# EAGLE design n64rgbv2 (EAGLE 9.2.2)
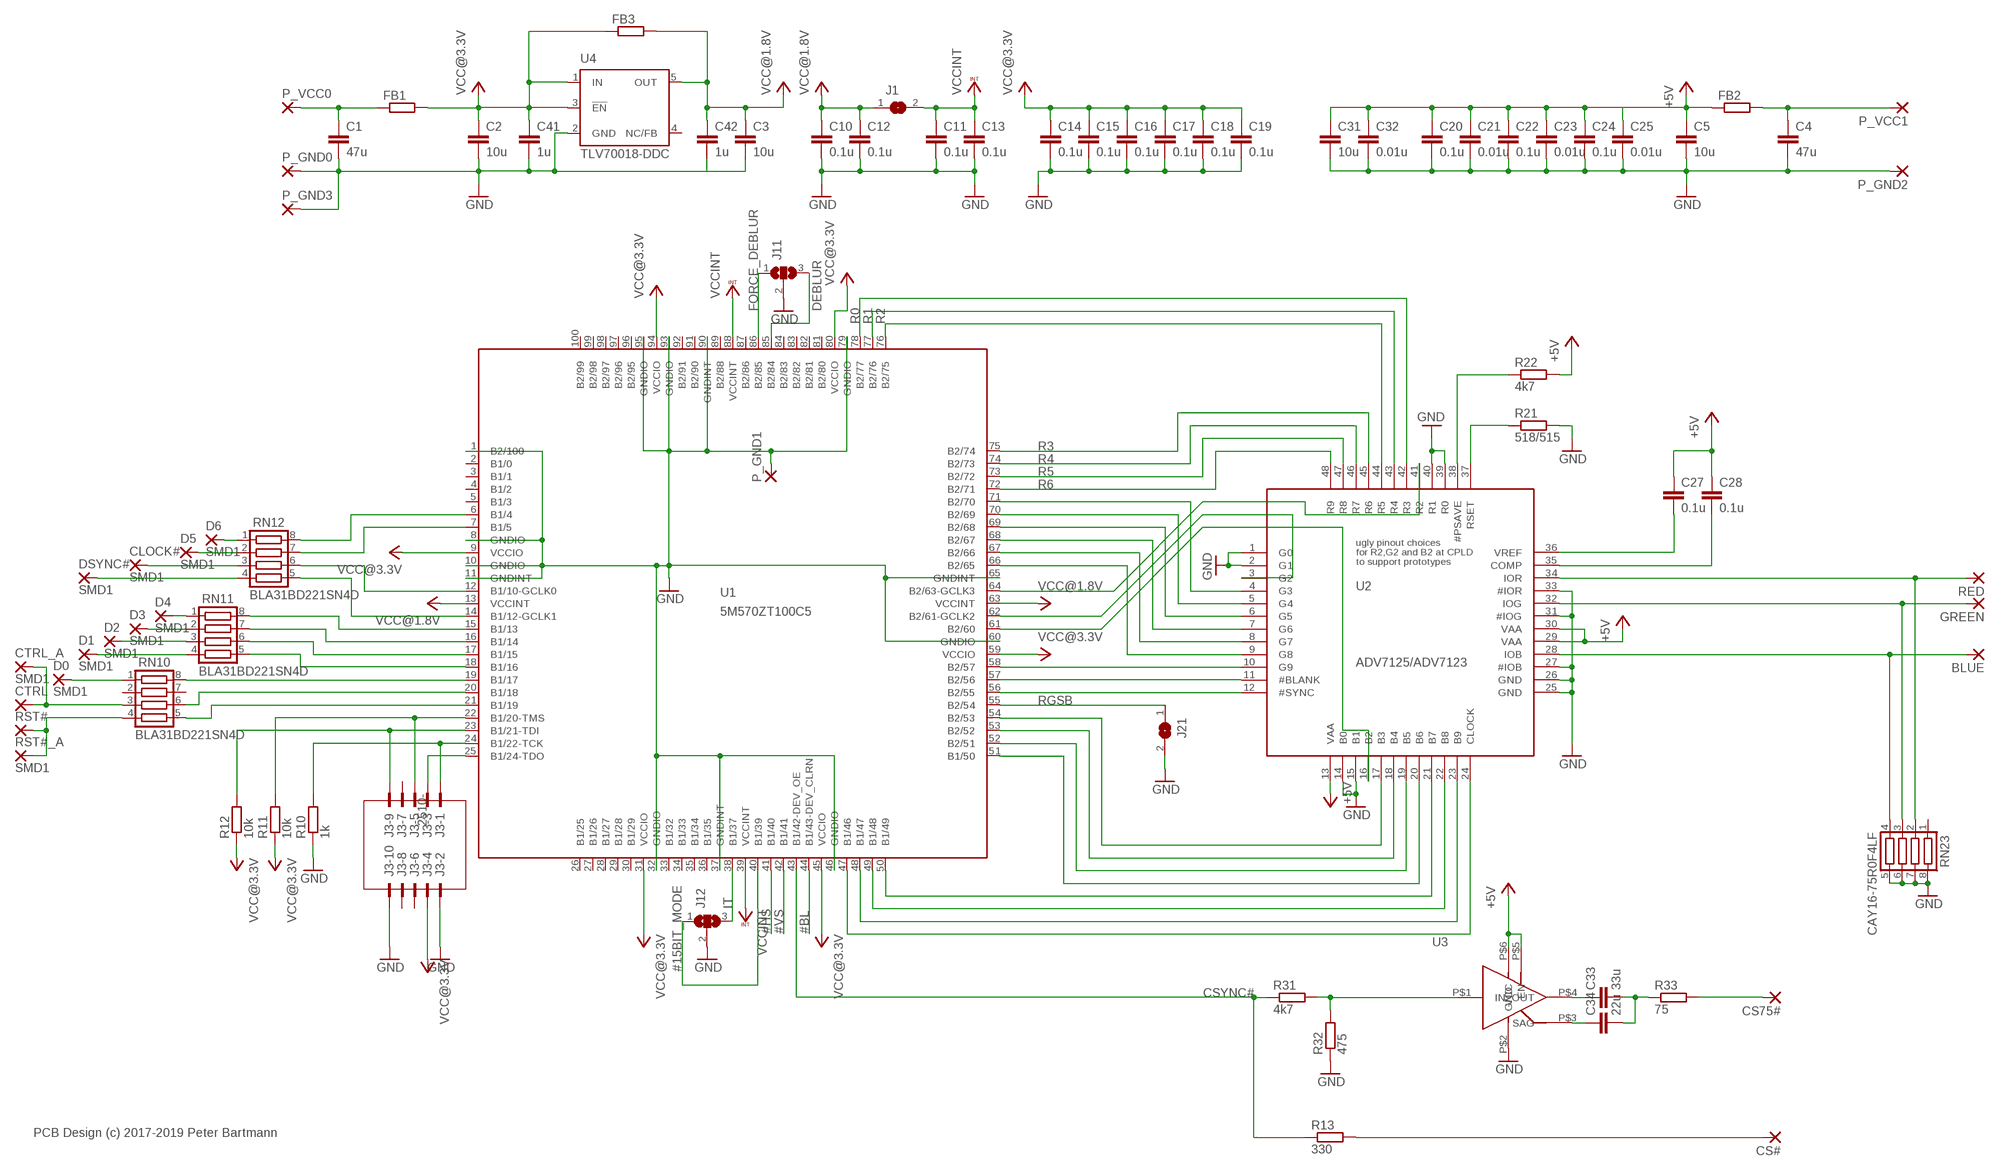
[diagram p0: schematic, sheet 1]

## Parts
BLUE  SMD2  [SMD1,27-2,54]
C1  47u  C-EUC0805  [C0805]
C2  10u  C-EUC0805  [C0805]
C3  10u  C-EUC0805  [C0805]
C4  47u  C-EUC0805  [C0805]
C5  10u  C-EUC0805  [C0805]
C10  0.1u  C-EUC0603  [C0603]
C11  0.1u  C-EUC0603  [C0603]
C12  0.1u  C-EUC0603  [C0603]
C13  0.1u  C-EUC0603  [C0603]
C14  0.1u  C-EUC0603  [C0603]
C15  0.1u  C-EUC0603  [C0603]
C16  0.1u  C-EUC0603  [C0603]
C17  0.1u  C-EUC0603  [C0603]
C18  0.1u  C-EUC0603  [C0603]
C19  0.1u  C-EUC0603  [C0603]
C20  0.1u  C-EUC0603  [C0603]
C21  0.01u  C-EUC0603  [C0603]
C22  0.1u  C-EUC0603  [C0603]
C23  0.01u  C-EUC0603  [C0603]
C24  0.1u  C-EUC0603  [C0603]
C25  0.01u  C-EUC0603  [C0603]
C27  0.1u  C-EUC0603  [C0603]
C28  0.1u  C-EUC0603  [C0603]
C31  10u  C-EUC0805  [C0805]
C32  0.01u  C-EUC0603  [C0603]
C33  33u  C-EUC1210  [C1210]
C34  22u  C-EUC1206  [C1206]
C41  1u  C-EUC0603  [C0603]
C42  1u  C-EUC0603  [C0603]
CLOCK#  SMD1  [SMD0,8-1,6]
CS75#  SMD2  [SMD1,27-2,54]
CS#  SMD2  [SMD1,27-2,54]
CTRL  SMD2  [SMD1,27-2,54]
CTRL_A  SMD1  [SMD0,8-1,6]
D0  SMD1  [SMD0,8-1,6]
D1  SMD1  [SMD0,8-1,6]
D2  SMD1  [SMD0,8-1,6]
D3  SMD1  [SMD0,8-1,6]
D4  SMD1  [SMD0,8-1,6]
D5  SMD1  [SMD0,8-1,6]
D6  SMD1  [SMD0,8-1,6]
DSYNC#  SMD1  [SMD0,8-1,6]
FB1  R-EU_R0603  [R0603]
FB2  R-EU_R0603  [R0603]
FB3  R-EU_R0603  [R0603]
GREEN  SMD2  [SMD1,27-2,54]
J1  SJ  [SJ]
J3  2510-  [PAK100/2500-10]
J11  SJ2W  [SJ_2]
J12  SJ2W  [SJ_2]
J21  SJ  [SJ]
P_GND0  SMD2  [SMD1,27-2,54]
P_GND1  SMD2  [SMD1,27-2,54]
P_GND2  SMD2  [SMD1,27-2,54]
P_GND3  SMD2  [SMD1,27-2,54]
P_VCC0  SMD2  [SMD1,27-2,54]
P_VCC1  SMD2  [SMD1,27-2,54]
R10  1k  R-EU_R0603  [R0603]
R11  10k  R-EU_R0603  [R0603]
R12  10k  R-EU_R0603  [R0603]
R13  330  R-EU_R0603  [R0603]
R21  518/515  R-EU_R0603  [R0603]
R22  4k7  R-EU_R0603  [R0603]
R31  4k7  R-EU_R0603  [R0603]
R32  475  R-EU_R0603  [R0603]
R33  75  R-EU_R0603  [R0603]
RED  SMD2  [SMD1,27-2,54]
RN10  BLA31BD221SN4D  CTS742C083  [CTS742C083]
RN11  BLA31BD221SN4D  CTS742C083  [CTS742C083]
RN12  BLA31BD221SN4D  CTS742C083  [CTS742C083]
RN23  CAY16-75R0F4LF  CTS742C083  [CTS742C083]
RST#  SMD2  [SMD1,27-2,54]
RST#_A  SMD1  [SMD0,8-1,6]
U1  5M570ZT100C5  [TQFP100]
U2  ADV7125/ADV7123  ADV7123  [LQFP48]
U3  TSH122ICT  [SC70]
U4  TLV70018-DDC  TPS77018  [SOT23-DBV]

## Nets
#15BIT_MODE: J12.1 U1.40(B1/39)
#BL: U1.44(B1/43-DEV_CLRN)
#HS: U1.41(B1/40)
#VS: U1.42(B1/41)
+5V: C5.1 C20.1 C21.1 C22.1 C23.1 C24.1 C25.1 C27.1 C28.1 C31.1 C32.1 FB2.1 R22.2 U2.13(VAA) U2.29(VAA) U2.30(VAA) U3.P$5(EN) U3.P$6(VCC)
BLUE: BLUE.1(P) RN23.4 U2.28(IOB)
CSYNC#: R13.1 R31.1 U1.43(B1/42-DEV_OE)
DEBLUR: J11.3 U1.85(B2/84)
FORCE_DEBLUR: J11.1 U1.86(B2/85)
GND: C1.2 C2.2 C3.2 C4.2 C5.2 C10.2 C11.2 C12.2 C13.2 C14.2 C15.2 C16.2 C17.2 C18.2 C19.2 C20.2 C21.2 C22.2 C23.2 C24.2 C25.2 C31.2 C32.2 C41.2 C42.2 J3.2 J3.10 J11.2 J12.2 J21.2 P_GND0.1(P) P_GND1.1(P) P_GND2.1(P) P_GND3.1(P) R10.1 R21.2 R32.1 RN23.5 RN23.6 RN23.7 RN23.8 U1.1(B2/100) U1.8(GNDIO) U1.10(GNDIO) U1.11(GNDINT) U1.32(GNDIO) U1.37(GNDINT) U1.46(GNDIO) U1.60(GNDIO) U1.65(GNDINT) U1.79(GNDIO) U1.90(GNDINT) U1.93(GNDIO) U1.95(GNDIO) U2.1(G0) U2.2(G1) U2.14(B0) U2.15(B1) U2.25(GND) U2.26(GND) U2.27(#IOB) U2.31(#IOG) U2.33(#IOR) U2.39(R0) U2.40(R1) U3.P$2(GND) U4.2(GND)
GREEN: GREEN.1(P) RN23.3 U2.32(IOG)
IT: J12.3 U1.38(B1/37)
N$1: D6.P$1(P) RN12.1
N$2: D5.P$1(P) RN12.2
N$3: DSYNC#.P$1(P) RN12.4
N$4: CLOCK#.P$1(P) RN12.3
N$5: RN10.4 RST#.1(P) RST#_A.P$1(P)
N$6: CTRL.1(P) CTRL_A.P$1(P) RN10.3
N$7: D0.P$1(P) RN10.1
N$8: RN10.8 U1.19(B1/17)
N$9: RN10.6 U1.20(B1/18)
N$10: RN10.5 U1.21(B1/19)
N$11: RN11.5 U1.18(B1/16)
N$12: RN11.6 U1.17(B1/15)
N$13: CS#.1(P) R13.2
N$14: RN11.7 U1.16(B1/14)
N$15: RN11.8 U1.15(B1/13)
N$16: D1.P$1(P) RN11.4
N$17: D2.P$1(P) RN11.3
N$18: D3.P$1(P) RN11.2
N$19: D4.P$1(P) RN11.1
N$20: RN12.7 U1.7(B1/5)
N$21: RN12.8 U1.6(B1/4)
N$22: RN12.5 U1.14(B1/12-GCLK1)
N$23: RN12.6 U1.12(B1/10-GCLK0)
N$24: U1.71(B2/70) U2.4(G3)
N$25: U1.64(B2/63-GCLK3) U2.41(R2)
N$26: U1.70(B2/69) U2.5(G4)
N$27: U1.69(B2/68) U2.6(G5)
N$28: U1.68(B2/67) U2.7(G6)
N$29: U1.67(B2/66) U2.8(G7)
N$30: U1.66(B2/65) U2.9(G8)
N$31: U1.58(B2/57) U2.10(G9)
N$32: U1.56(B2/55) U2.12(#SYNC)
N$33: U1.47(B1/46) U2.24(CLOCK)
N$34: U1.48(B1/47) U2.23(B9)
N$35: U1.49(B1/48) U2.22(B8)
N$36: U1.50(B1/49) U2.21(B7)
N$37: U1.51(B1/50) U2.20(B6)
N$38: U1.52(B2/51) U2.19(B5)
N$39: U1.53(B2/52) U2.18(B4)
N$40: U1.54(B2/53) U2.17(B3)
N$41: U1.62(B2/61-GCLK2) U2.3(G2)
N$42: U1.57(B2/56) U2.11(#BLANK)
N$43: U1.61(B2/60) U2.16(B2)
N$44: C4.1 FB2.2 P_VCC1.1(P)
N$54: C1.1 FB1.1 P_VCC0.1(P)
N$57: C33.2 C34.2 R33.1
N$58: CS75#.1(P) R33.2
N$59: C33.1 U3.P$4(OUT)
N$60: C34.1 U3.P$3(SAG)
N$61: R21.1 U2.37(RSET)
N$62: R22.1 U2.38(#PSAVE)
N$63: C28.2 U2.35(COMP)
N$64: R31.2 R32.2 U3.P$1(IN)
N$88: C27.2 U2.36(VREF)
R0: U1.78(B2/77) U2.42(R3)
R1: U1.77(B2/76) U2.43(R4)
R2: U1.76(B2/75) U2.44(R5)
R3: U1.75(B2/74) U2.45(R6)
R4: U1.74(B2/73) U2.46(R7)
R5: U1.73(B2/72) U2.47(R8)
R6: U1.72(B2/71) U2.48(R9)
RED: RED.1(P) RN23.2 U2.34(IOR)
RGSB: J21.1 U1.55(B2/54)
TCK: J3.1 R10.2 U1.24(B1/22-TCK)
TDI: J3.9 R12.2 U1.23(B1/21-TDI)
TDO: J3.3 U1.25(B1/24-TDO)
TMS: J3.5 R11.2 U1.22(B1/20-TMS)
VCC@1.8V: C3.1 C10.1 C12.1 C42.1 FB3.2 J1.1 U1.13(VCCINT) U1.63(VCCINT) U4.5(OUT)
VCC@3.3V: C2.1 C14.1 C15.1 C16.1 C17.1 C18.1 C19.1 C41.1 FB1.2 FB3.1 J3.4 R11.1 R12.1 U1.9(VCCIO) U1.31(VCCIO) U1.45(VCCIO) U1.59(VCCIO) U1.80(VCCIO) U1.94(VCCIO) U4.1(IN) U4.3(!EN)
VCCINT: C11.1 C13.1 J1.2 U1.39(VCCINT) U1.88(VCCINT)
Unconnected: J3.6 J3.7 J3.8 RN10.2 RN10.7 RN23.1 U1.2(B1/0) U1.3(B1/1) U1.4(B1/2) U1.5(B1/3) U1.26(B1/25) U1.27(B1/26) U1.28(B1/27) U1.29(B1/28) U1.30(B1/29) U1.33(B1/32) U1.34(B1/33) U1.35(B1/34) U1.36(B1/35) U1.81(B2/80) U1.82(B2/81) U1.83(B2/82) U1.84(B2/83) U1.87(B2/86) U1.89(B2/88) U1.91(B2/90) U1.92(B2/91) U1.96(B2/95) U1.97(B2/96) U1.98(B2/97) U1.99(B2/98) U1.100(B2/99) U4.4(NC/FB)

## Notes on the sheet
- ugly pinout choices
  for R2,G2 and B2 at CPLD
  to support prototypes
- PCB Design (c) 2017-2019 Peter Bartmann

## Library data of the parts
BLUE CS75# CS# CTRL GREEN P_GND0 P_GND1-P_GND3 P_VCC0 P_VCC1 RED RST# = wirepad:SMD2: SMD PAD
C1-C5 C10-C25 C27 C28 C31 C32 C34 C41 C42 = rcl:C-EU: CAPACITOR, European symbol
C33 = rcl@1:C-EU: CAPACITOR, European symbol
CLOCK# CTRL_A D0 D1-D6 DSYNC# RST#_A = wirepad:SMD1
FB1-FB3 R10-R13 R21 R22 R31-R33 = rcl:R-EU_: RESISTOR, European symbol
J1 J21 = jumper:SJ: SMD solder JUMPER
J3 = con-3m:2510-: 3M (TM) Pak 100 4-Wall Header Source: 3M; MF: 3M; MPN: 2510-6002UB; OC_FARNELL: 9838244; OC_NEWARK: 46F4725
J11 J12 = jumper:SJ2W: SMD solder JUMPER
RN10-RN12 RN23 = resistor-net:CTS742C083: Chip Resistor Array 4 Single Resistor Source: http://www.ctscorp.com/components/Datasheets/CTSChipArrayDs.pdf; OC_FARNELL: unknown; OC_NEWARK: unknown
U1 = altera:5M570ZT100C5
U2 = analog-devices:ADV7123
U3 = st-microelectronics:TSH122
U4 = texas:TPS770*: ULTRALOW-POWER 50-mA LOW-DROPOUT LINEAR REGULATORS 50-mA Low-Dropout Regulator Source: http://focus.ti.com/lit/ds/symlink/tps77001.pdf; MF: TEXAS INSTRUMENT CONNECTORS; MPN: TPS77018DBVR; OC_FARNELL: 1575745; OC_NEWARK: 77C1176

## Board
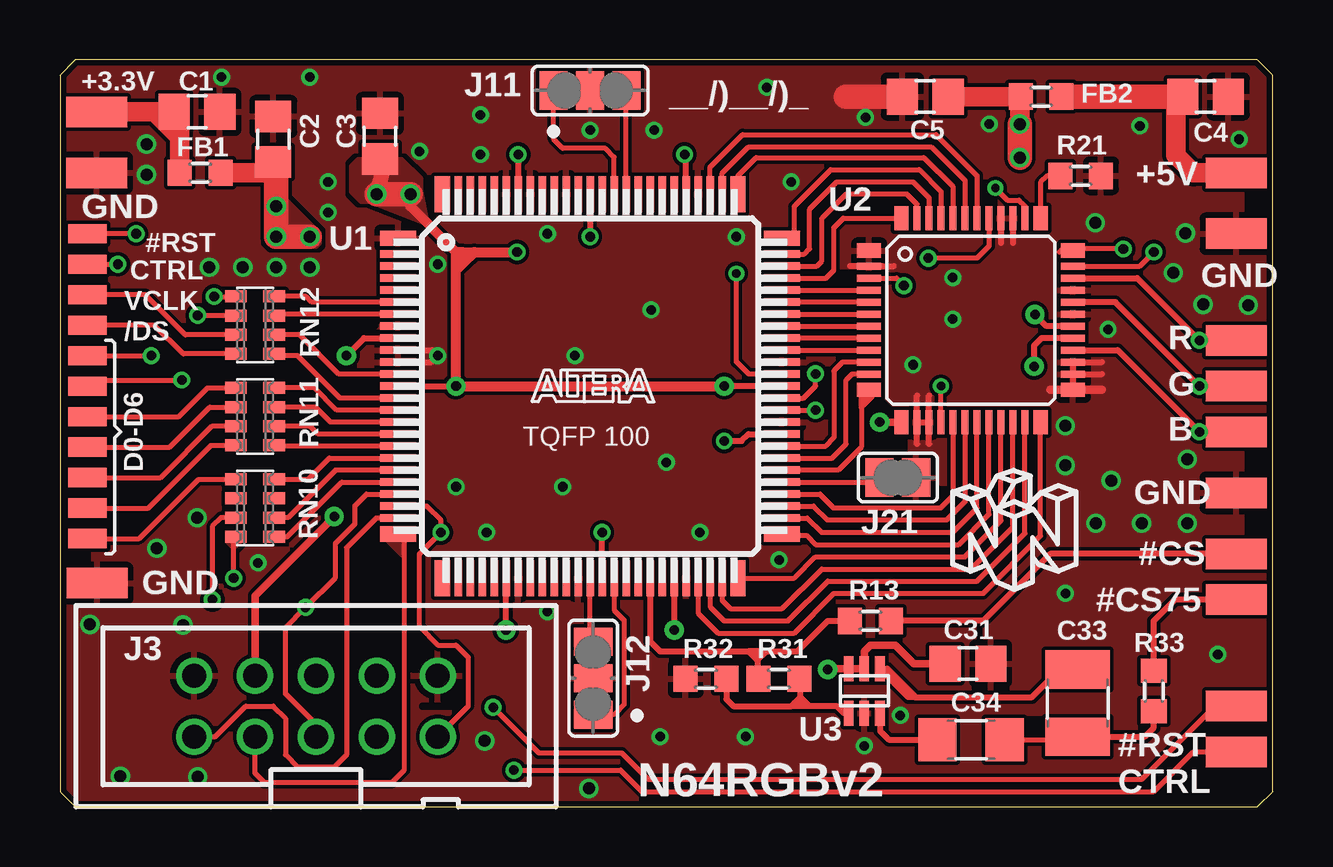
[diagram p1: board, top side]
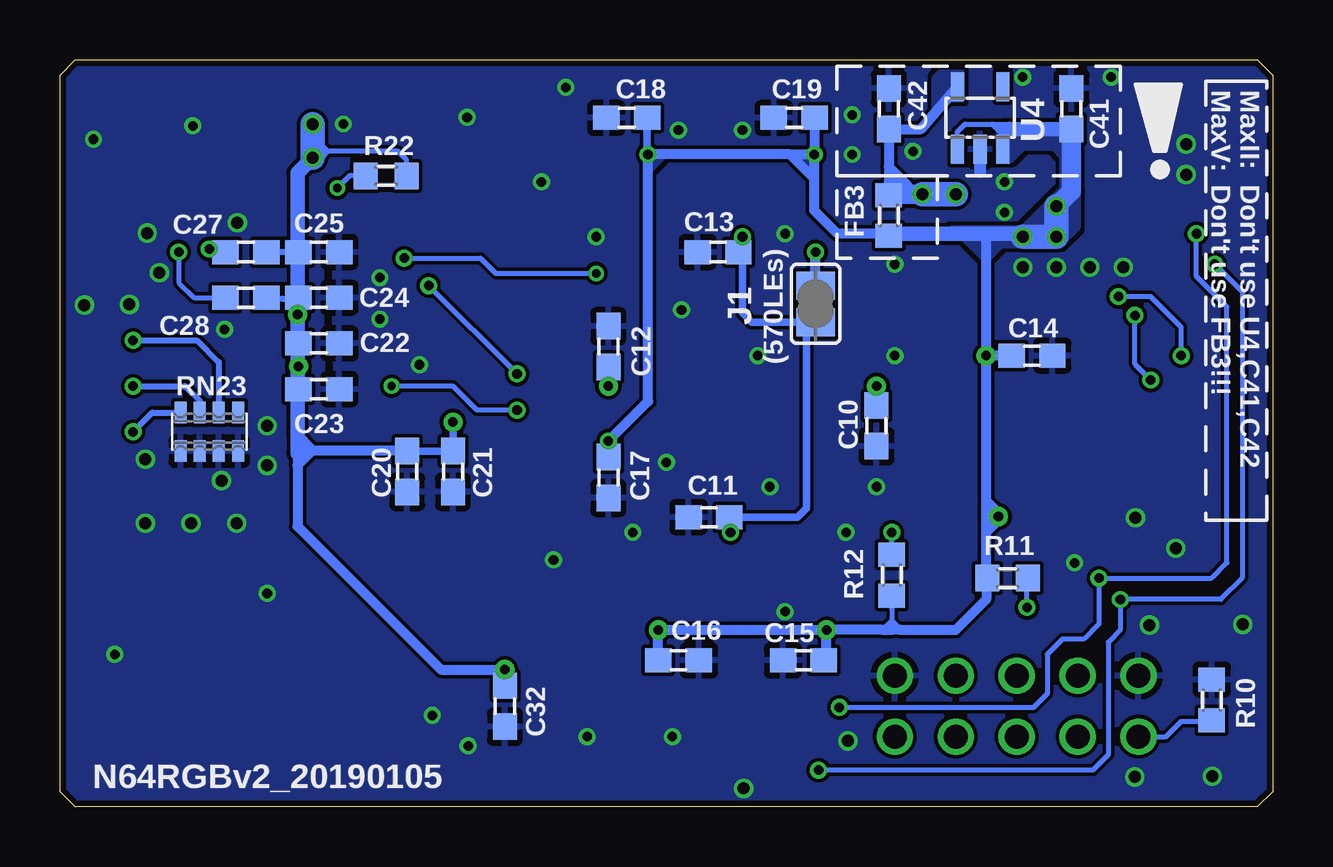
[diagram p2: board, bottom side, seen from below]

Size 50.55 x 31.11 mm. Coordinates in mm from the lower left corner, seen from the top.
Outline: 0.64,0 49.91,0 50.55,0.64 50.55,30.48 49.91,31.11 0.64,31.11 0,30.48 0,0.64 0.64,0
Copper layers (1*16): Top 0.035mm / dielectric 1.5mm / Bottom 0.035mm
Design rules "Elecrow_2-layer_eagle_rule *": minimum track width 6mil, minimum drill 12mil, track to track 6mil, track to pad 6mil, pad to pad 6mil, via to via 6mil, smd to smd 0mil, copper to edge 10mil, drill to drill 10mil, minimum pad ring 10mil, minimum via ring 6mil, stop-mask expansion 2mil, vias tented up to drill 300mil, thermal gap 10mil
tRestrict: 17 lines
bRestrict: 4 lines

### Footprints (pad centres in the part's own frame; a part is rotated, then mirrored left to right if it is on the bottom)
SMD1,27-2,54 = smd 1.27 x 2.54: 1 0,0
C0805 = smd 1.3 x 1.5: 1 -0.95,0; 2 0.95,0
C0603 = smd 1.1 x 1: 1 -0.85,0; 2 0.85,0
C1210 = smd 1.6 x 2.7: 1 -1.4,0; 2 1.4,0
C1206 = smd 1.6 x 1.8: 1 -1.4,0; 2 1.4,0
SMD0,8-1,6 = smd 0.8 x 1.6: P$1 0,0
R0603 = smd 1 x 1.1: 1 -0.85,0; 2 0.85,0
SJ = smd 1.168 x 1.6: 1 -0.762,0; 2 0.762,0
PAK100/2500-10 = drill 1 pad 1.422: 1 -5.08,-1.27; 2 -5.08,1.27; 3 -2.54,-1.27; 4 -2.54,1.27; 5 0,-1.27; 6 0,1.27; 7 2.54,-1.27; 8 2.54,1.27; 9 5.08,-1.27; 10 5.08,1.27
SJ_2 = smd 1.168 x 1.6: 1 -1.524,0; 2 0,0; 3 1.524,0
CTS742C083 = smd 0.5 x 0.9: 1 -1.2,-0.8; 2 -0.4,-0.8; 3 0.4,-0.8; 4 1.2,-0.8; 5 1.2,0.8; 6 0.4,0.8; 7 -0.4,0.8; 8 -1.2,0.8
TQFP100 = smd 1.5 x 0.64: 1 -8,6.16; 25 -8,-6.16; 51 8,-6.16; 75 8,6.16 | smd 1.5 x 0.32: 2 -8,5.5; 3 -8,5; 4 -8,4.5; 5 -8,4; 6 -8,3.5; 7 -8,3; 8 -8,2.5; 9 -8,2; 10 -8,1.5; 11 -8,1; 12 -8,0.5; 13 -8,0; 14 -8,-0.5; 15 -8,-1; 16 -8,-1.5; 17 -8,-2; 18 -8,-2.5; 19 -8,-3; 20 -8,-3.5; 21 -8,-4; 22 -8,-4.5; 23 -8,-5; 24 -8,-5.5; 52 8,-5.5; 53 8,-5; 54 8,-4.5; 55 8,-4; 56 8,-3.5; 57 8,-3; 58 8,-2.5; 59 8,-2; 60 8,-1.5; 61 8,-1; 62 8,-0.5; 63 8,0; 64 8,0.5; 65 8,1; 66 8,1.5; 67 8,2; 68 8,2.5; 69 8,3; 70 8,3.5; 71 8,4; 72 8,4.5; 73 8,5; 74 8,5.5 | smd 0.64 x 1.5: 26 -6.16,-8; 50 6.16,-8; 76 6.16,8; 100 -6.16,8 | smd 0.32 x 1.5: 27 -5.5,-8; 28 -5,-8; 29 -4.5,-8; 30 -4,-8; 31 -3.5,-8; 32 -3,-8; 33 -2.5,-8; 34 -2,-8; 35 -1.5,-8; 36 -1,-8; 37 -0.5,-8; 38 0,-8; 39 0.5,-8; 40 1,-8; 41 1.5,-8; 42 2,-8; 43 2.5,-8; 44 3,-8; 45 3.5,-8; 46 4,-8; 47 4.5,-8; 48 5,-8; 49 5.5,-8; 77 5.5,8; 78 5,8; 79 4.5,8; 80 4,8; 81 3.5,8; 82 3,8; 83 2.5,8; 84 2,8; 85 1.5,8; 86 1,8; 87 0.5,8; 88 0,8; 89 -0.5,8; 90 -1,8; 91 -1.5,8; 92 -2,8; 93 -2.5,8; 94 -3,8; 95 -3.5,8; 96 -4,8; 97 -4.5,8; 98 -5,8; 99 -5.5,8
LQFP48 = smd 1 x 0.6: 1 -4.25,2.9; 12 -4.25,-2.9; 25 4.25,-2.9; 36 4.25,2.9 | smd 1 x 0.3: 2 -4.25,2.25; 3 -4.25,1.75; 4 -4.25,1.25; 5 -4.25,0.75; 6 -4.25,0.25; 7 -4.25,-0.25; 8 -4.25,-0.75; 9 -4.25,-1.25; 10 -4.25,-1.75; 11 -4.25,-2.25; 26 4.25,-2.25; 27 4.25,-1.75; 28 4.25,-1.25; 29 4.25,-0.75; 30 4.25,-0.25; 31 4.25,0.25; 32 4.25,0.75; 33 4.25,1.25; 34 4.25,1.75; 35 4.25,2.25 | smd 0.6 x 1: 13 -2.9,-4.25; 24 2.9,-4.25; 37 2.9,4.25; 48 -2.9,4.25 | smd 0.3 x 1: 14 -2.25,-4.25; 15 -1.75,-4.25; 16 -1.25,-4.25; 17 -0.75,-4.25; 18 -0.25,-4.25; 19 0.25,-4.25; 20 0.75,-4.25; 21 1.25,-4.25; 22 1.75,-4.25; 23 2.25,-4.25; 38 2.25,4.25; 39 1.75,4.25; 40 1.25,4.25; 41 0.75,4.25; 42 0.25,4.25; 43 -0.25,4.25; 44 -0.75,4.25; 45 -1.25,4.25; 46 -1.75,4.25; 47 -2.25,4.25
SC70 = smd 0.4 x 1.05: P$1 -0.65,-0.925; P$2 0,-0.925; P$3 0.65,-0.925; P$4 0.65,0.925; P$5 0,0.925; P$6 -0.65,0.925
SOT23-DBV = smd 0.55 x 1.2: 1 -0.95,-1.3; 2 0,-1.3; 3 0.95,-1.3; 4 0.95,1.3; 5 -0.95,1.3

### Placement (x,y rotation side)
BLUE  49.02,15.62 90 top
C1  5.71,28.96 0 top
C2  8.89,27.81 90 top
C3  13.34,27.94 90 top
C4  47.75,29.59 0 top
C5  36.07,29.59 180 top
C10  16.51,15.88 270 bottom
C11  23.5,12.06 180 bottom
C12  27.69,19.18 90 bottom
C13  23.11,23.11 180 bottom
C14  10.03,18.8 0 bottom
C15  19.56,6.1 180 bottom
C16  24.77,6.1 0 bottom
C17  27.69,13.72 270 bottom
C18  26.92,28.7 180 bottom
C19  19.94,28.7 180 bottom
C20  36.07,13.97 270 bottom
C21  34.16,13.97 270 bottom
C22  39.75,19.3 0 bottom
C23  39.75,17.4 0 bottom
C24  39.75,21.21 0 bottom
C25  39.75,23.11 0 bottom
C27  42.8,23.11 180 bottom
C28  42.8,21.21 180 bottom
C31  37.85,5.97 0 top
C32  32,4.19 270 bottom
C33  42.42,4.32 270 top
C34  37.97,2.79 0 top
C41  8.38,29.08 90 bottom
C42  16,29.08 90 bottom
CLOCK#  1.14,21.34 90 top
CS75#  49.02,8.64 90 top
CS#  49.02,10.54 90 top
CTRL  49.02,2.29 90 top
CTRL_A  1.14,22.61 270 top
D0  1.14,11.18 90 top
D1  1.14,12.45 90 top
D2  1.14,13.72 90 top
D3  1.14,14.99 90 top
D4  1.14,16.26 90 top
D5  1.14,17.53 90 top
D6  1.14,18.8 90 top
DSYNC#  1.14,20.07 90 top
FB1  5.84,26.42 0 top
FB2  40.89,29.59 0 top
FB3  16,24.64 90 bottom
GREEN  49.02,17.53 90 top
J1  19.05,20.95 270 bottom
J3  10.67,4.19 0 top
J11  22.1,29.84 0 top
J12  22.23,5.36 90 top
J21  34.92,13.72 0 top
P_GND0  1.52,26.42 270 top
P_GND1  49.02,23.88 90 top
P_GND2  49.02,13.08 90 top
P_GND3  1.55,9.32 90 top
P_VCC0  1.52,28.96 270 top
P_VCC1  49.02,26.42 90 top
R10  2.54,4.45 270 bottom
R11  11.05,9.53 0 bottom
R12  15.88,9.65 90 bottom
R13  33.78,7.75 0 top
R21  42.55,26.29 0 top
R22  36.96,26.29 0 bottom
R31  29.97,5.33 0 top
R32  26.92,5.33 0 top
R33  45.59,4.83 90 top
RED  49.02,19.43 90 top
RN10  8.13,12.45 270 top
RN11  8.13,16.26 270 top
RN12  8.13,20.07 270 top
RN23  44.32,15.62 180 bottom
RST#  49.02,4.19 90 top
RST#_A  1.14,23.88 270 top
U1  22.1,17.53 0 top
U2  37.97,20.28 0 top
U3  33.53,4.83 0 top
U4  12.19,28.7 0 bottom

### Tracks (layer width: path | path; a pad name or v marks a point on that pad's centre or on a via)
#15BIT_MODE
  Top 0.203: U1.40 23.1,8.2 23.52,7.77 23.52,4.27 23.09,3.83 J12.1
+5V  (via drill 0.4 pad 0.8, 0.5)
  Top 0.254: U2.30 41.12,20.03 v40.64,20.51 | U2.29 40.92,19.53 40.6,19.21 v40.6,18.35
  Top 0.305: v32,5.71 32.04,5.75 U3.P$6 U3.P$5 33.53,6.48 33.78,6.73 34.82,6.73 35.58,5.97 C31.1 | U2.13 v34.16,16.03
  Top 0.813: C5.1 FB2.1 40.01,29.55 v40.01,28.45
  Top 1.016: v40.01,28.45 v40.01,27.05
  Bottom 0.203: 39.37,27.3 36.45,27.3 36.11,26.96 R22.2 | v40.01,28.45 40.01,27.94 39.37,27.3 | v40.01,27.05 39.62,27.05 39.37,27.3
  Bottom 0.254: 40.64,21.17 v40.64,20.51 | 40.64,21.17 C24.1 | C28.1 41.27,21.17 40.64,21.17 | C27.1 40.64,23.11 40.26,23.11 40.64,22.86
  Bottom 0.305: C20.1 C21.1 v34.16,16.03 | 40.6,17.49 v40.6,18.35 C22.1 | C24.1 C25.1 | v32,5.71 C32.1
  Bottom 0.406: 40.64,14.22 40.64,14.73 40.01,14.86 | 40.64,14.22 40.64,11.68 34.67,5.71 v32,5.71 | C23.1 40.6,17.49 40.64,17.53 | 40.64,14.22 40.01,14.86 | 40.01,14.86 40.64,15.49 | C20.1 36.01,14.86 40.01,14.86
  Bottom 0.61: 40.64,14.73 40.64,15.49 40.64,17.53 40.64,21.17 40.64,22.86 | v40.01,27.05 40.64,26.42 40.64,23.11
  Bottom 1.016: v40.01,28.45 v40.01,27.05
BLUE  (via drill 0.4)
  Top 0.254: U2.28 44.09,19.03 v47.5,15.62 BLUE.1
  Bottom 0.254: v47.5,15.62 46.7,16.42 RN23.4
CSYNC#
  Top 0.254: U1.43 24.6,6.9 25.02,6.48 28.7,6.48 | 28.7,6.48 29.08,6.1 | 29.08,6.35 29.08,6.1 | 29.08,6.1 29.08,5.37 R31.1 | R13.1 32,7.75 30.73,6.48 29.46,6.48 | 29.46,6.48 28.7,6.48 | 29.08,6.1 29.46,6.48
DEBLUR
  Top 0.203: U1.85 23.6,29.82 J11.3
FORCE_DEBLUR
  Top 0.203: U1.86 23.1,27.07 22.73,27.43 20.95,27.43 20.57,27.81 J11.1
GND  (via drill 0.4, 0.5)
  Top 0.254: U1.10 15.52,19.03 v15.75,18.8 15.48,18.53 U1.11 | 35.72,15.11 U2.14 | 36.22,15.11 U2.15 | U2.15 36.22,17.14 | U2.14 35.72,17.14 | U2.40 39.22,23.5 | U2.39 39.72,23.5 | U2.14 U2.15 | U2.26 U2.27 43.43,18.53 | U2.26 U2.25 | U2.26 43.43,18.03 | 34.29,22.53 U2.2 | U2.2 32.94,22.53 | U2.2 34.75,22.53
  Top 0.356: 43.43,17.38 U2.25 41.27,17.38
  Top 1.016: 32.77,29.59 C5.2
  Bottom 0.508: U4.2 12.19,26.44
  other vias: 7.62,22.48 3.61,27.61 9.02,22.48 6.22,22.48 10.41,22.48 43.81,13.59 43.18,11.81 45.09,11.81 46.99,14.48 46.99,11.81 41.91,14.22 41.91,15.88 49.53,20.9 47.65,20.93 46.41,22.25 46.91,23.9 43.15,24.33 17.53,27.18 17.53,28.83 22.1,28.19 10.41,30.4 14.99,27.3 15.75,22.61 20.32,23.88 28.19,23.75 8.26,10.16 30.48,26.04 35.56,18.41 37.21,20.32 37.21,22.05 38.73,28.45 49.15,27.81 16.51,13.34 20.95,13.34 20.32,8.13 28.57,2.92 25.02,2.92 33.53,2.54 41.91,8.89 48.26,6.35 24.77,28.19 33.58,28.73 17.78,11.43 29.97,10.29 26.67,11.43 21.46,18.8 24.64,20.7 25.27,14.35 35.03,3.81 6.73,30.4 22.05,0.76 5.71,12.04 5.13,7.57 4.04,10.77 5.74,1.24 1.24,7.59 2.51,1.27 29.46,29.97 45.01,28.37 11.18,26.04 11.18,24.77 43.69,19.89 17.7,2.74 3.61,26.34
  pour Bottom (rank 6): 0,0 50.8,0 50.8,31.75 0,31.75
  pour Top (rank 6): 0,0 50.8,0 50.8,31.75 0,31.75
GREEN  (via drill 0.4)
  Top 0.254: U2.32 44,21.03 v47.5,17.53 GREEN.1
  Bottom 0.254: v47.5,17.53 45.34,17.53 44.72,16.91 RN23.3
IT
  Top 0.203: U1.38 22.1,6.91 22.2,6.91 J12.3
N$1  (via drill 0.4)
  Top 0.203: D6.P$1 v3.81,18.8 | v6.43,21.26 RN12.1
  Bottom 0.203: v3.81,18.8 3.81,19.99 5.08,21.26 v6.43,21.26
N$2  (via drill 0.4)
  Top 0.203: D5.P$1 1.4,17.78 v5.08,17.78 | v5.74,20.47 RN12.2
  Bottom 0.203: v5.74,20.47 5.74,18.44 v5.08,17.78
N$3
  Top 0.203: DSYNC#.P$1 3.94,20.07 5.14,18.87 RN12.4
N$4
  Top 0.203: CLOCK#.P$1 3.56,21.34 5.23,19.67 RN12.3
N$5  (via drill 0.4)
  Top 0.203: RST#.1 48.13,4.19 45.09,1.14 24.51,1.14 23.42,2.23 19.96,2.23 v18.06,4.14 | v7.24,9.53 7.24,11.16 RN10.4 | v3.17,23.88 RST#_A.P$1
  Bottom 0.203: v18.06,4.14 9.96,4.14 9.4,4.7 9.4,6.35 8.76,6.99 7.87,6.99 7.24,7.62 v7.24,9.53 2.54,9.53 1.91,10.16 1.91,20.83 3.17,22.1 v3.17,23.88
  pour Top (no thermals): 7.24,10.79 7.62,11.18 7.62,11.3 6.99,11.3 6.99,11.18 6.99,11.05
N$6  (via drill 0.4)
  Top 0.203: CTRL.1 47.24,2.29 45.59,0.64 24.26,0.64 23.37,1.52 v18.92,1.52 | RN10.3 6.71,12.05 6.35,11.68 v6.35,8.64 | CTRL_A.P$1 v2.41,22.61
  Bottom 0.203: v18.92,1.52 7.49,1.52 6.86,2.16 6.86,6.86 6.35,7.37 v6.35,8.64 2.16,8.64 1.27,9.53 1.27,21.46 v2.41,22.61
N$7
  Top 0.203: D0.P$1 3.3,11.18 5.77,13.65 RN10.1
N$8
  Top 0.203: U1.19 11.22,14.53 10.34,13.65 RN10.8
N$9
  Top 0.203: RN10.6 9.51,12.05 11.49,14.03 U1.20
N$10
  Top 0.203: RN10.5 9.47,11.25 11.75,13.53 U1.21
N$11
  Top 0.203: U1.18 8.96,15.03 RN11.5
N$12
  Top 0.203: U1.17 10.76,15.53 10.43,15.86 RN11.6
N$13
  Top 0.254: R13.2 38.48,7.75 41.27,10.54 CS#.1
N$14
  Top 0.203: U1.16 11.28,16.03 10.65,16.66 RN11.7
N$15
  Top 0.203: U1.15 11.54,16.53 10.61,17.46 RN11.8
N$16
  Top 0.203: D1.P$1 3.68,12.45 6.29,15.06 RN11.4
N$17
  Top 0.203: D2.P$1 4.19,13.72 6.35,15.88 7.31,15.88 RN11.3
N$18
  Top 0.203: D3.P$1 4.57,14.99 6.24,16.66 RN11.2
N$19
  Top 0.203: D4.P$1 4.95,16.26 6.15,17.46 RN11.1
N$20
  Top 0.203: U1.7 8.99,20.53 RN12.7
N$21
  Top 0.203: U1.6 10.49,21.03 10.26,21.27 RN12.8
N$22
  Top 0.203: U1.14 11.68,17.03 9.91,18.8 9,18.8 RN12.5
N$23
  Top 0.203: U1.12 11.62,18.03 9.98,19.66 RN12.6
N$24
  Top 0.203: U1.71 U2.4
N$25  (via drill 0.35, 0.4)
  Top 0.203: U1.64 28.71,18.03 28.19,18.54 v28.19,22.23 | v36.2,22.86 38.23,22.86 38.72,23.36 U2.41
  Bottom 0.203: v36.2,22.86 33.02,22.86 32.38,22.23 v28.19,22.23
N$26
  Top 0.203: U2.5 U1.70
N$27
  Top 0.203: U1.69 U2.6
N$28
  Top 0.203: U1.68 U2.7
N$29
  Top 0.203: U2.8 U1.67
N$30
  Top 0.203: U1.66 U2.9
N$31
  Top 0.203: U1.58 31.92,15.03 32.26,15.37 32.26,18.16 32.62,18.53 U2.10
N$32
  Top 0.203: U2.12 33.38,17.38 33.4,17.4 33.4,16.89 | U1.56 32.44,14.03 33.4,14.99 33.4,16.64 | 33.4,16.64 33.4,16.89 | U2.12 33.72,17.21 33.4,16.89 | U2.12 33.85,17.09 33.4,16.64
N$33
  Top 0.203: U1.47 26.6,8.07 27.43,7.24 30.61,7.24 32.26,8.89 38.48,8.89 40.87,11.28 U2.24
N$34
  Top 0.203: U1.48 27.1,8.34 27.69,7.75 30.35,7.75 32,9.4 38.23,9.4 40.22,11.39 U2.23
N$35
  Top 0.203: U1.49 27.6,8.6 27.94,8.26 30.1,8.26 31.75,9.91 37.97,9.91 39.72,11.66 U2.22
N$36
  Top 0.203: U1.50 30.61,9.53 31.5,10.41 37.72,10.41 39.22,11.92 U2.21
N$37
  Top 0.203: U1.51 30.16,11.3 31.11,11.3 31.5,10.92 37.47,10.92 38.72,12.18 U2.20
N$38
  Top 0.203: U1.52 31.15,12.03 31.75,11.43 37.21,11.43 38.22,12.44 U2.19
N$39
  Top 0.203: U1.53 31.42,12.53 32,11.94 36.96,11.94 37.72,12.7 U2.18
N$40
  Top 0.203: U1.54 31.68,13.03 32.26,12.45 36.7,12.45 37.22,12.97 U2.17
N$41  (via drill 0.4)
  Top 0.203: U1.62 31,17.03 31.5,17.53 v31.5,18.03 | U2.3 34.87,22.03 v35.18,21.72
  Bottom 0.203: v31.5,18.03 v35.18,21.72
N$42
  Top 0.203: U2.11 33.01,18.03 32.77,17.78 32.77,15.11 32.18,14.53 U1.57
N$43  (via drill 0.35, 0.4)
  Top 0.203: U1.61 v31.5,16.53 | U2.16 v36.72,17.53
  Bottom 0.203: v36.72,17.53 34.16,17.53 33.16,16.53 v31.5,16.53
N$44
  Top 0.813: P_VCC1.1 47.24,26.42 46.51,27.15 46.51,29.34 C4.1
  Top 1.016: FB2.2 C4.1
N$54
  Top 0.813: P_VCC0.1 3.94,28.96 | 3.94,28.96 C1.1 4.99,28.73 FB1.1 | 3.94,28.96 4.95,27.94
N$57
  Top 0.203: C34.2 42.29,2.79 C33.2
  Top 0.254: C33.2 45.21,2.92 45.59,3.3 R33.1
N$58
  Top 0.254: R33.2 45.59,7.75 46.48,8.64 CS75#.1
N$59
  Top 0.254: C33.1 41.66,5.72 40.51,4.57 35.61,4.57 | U3.P$4 34.48,5.75 35.05,5.18 | 35.05,5.18 35.15,5.08 34.85,5.08 U3.P$4 | U3.P$4 35.36,4.57 35.61,4.57 | 35.05,5.18 35.61,4.62 35.61,4.57
N$60
  Top 0.254: U3.P$3 34.18,3.16 34.54,2.79 C34.1
N$61
  Top 0.203: U2.37 40.87,26.01 41.15,26.29 R21.1
N$62  (via drill 0.35)
  Top 0.203: U2.38 40.22,25.04 39.98,25.28 39.49,25.28 v38.99,25.78
  Bottom 0.203: R22.1 38.48,26.29 v38.99,25.78
N$63  (via drill 0.4)
  Top 0.203: U2.35 45.01,22.53 v45.59,23.11
  Bottom 0.203: v45.59,23.11 45.59,21.84 44.96,21.21 C28.2
N$64
  Top 0.254: 30.48,4.19 28.07,4.19 27.77,4.48 R32.2 | 30.61,4.32 30.86,4.57 31.24,4.19 | 30.48,4.19 30.61,4.32 | 30.61,4.32 30.86,4.32 30.86,5.29 R31.2 | 32.38,4.19 30.48,4.19 | 32.38,4.19 32.84,4.19 U3.P$1 32.67,3.9 32.38,4.19
N$88  (via drill 0.4)
  Top 0.203: U2.36 41.65,23.11 41.78,23.24 v44.32,23.24
  Bottom 0.203: v44.32,23.24 43.78,23.24 C27.2
R0
  Top 0.203: U2.42 38.22,26.29 36.51,28 28.45,28 27.1,26.65 U1.78
R1
  Top 0.203: U1.77 27.6,26.39 28.7,27.5 36.32,27.5 37.72,26.09 U2.43
R2
  Top 0.203: U1.76 28.26,26.29 29.02,27.05 36.01,27.05 37.21,25.84 U2.44
R3
  Top 0.203: U1.75 30.16,23.75 30.73,23.75 30.61,23.88 30.61,25.02 32.13,26.54 35.81,26.54 36.72,25.63 U2.45
R4
  Top 0.203: U1.74 31.03,23.03 31.24,23.24 31.24,24.89 32.38,26.04 35.56,26.04 36.22,25.37 U2.46
R5
  Top 0.203: U1.73 31.54,22.53 31.75,22.73 31.75,24.51 32.77,25.53 35.31,25.53 35.72,25.11 U2.47
R6
  Top 0.203: U1.72 31.93,22.03 32.26,22.35 32.26,24.13 32.65,24.53 U2.48
RED  (via drill 0.4)
  Top 0.254: U2.34 44.9,22.03 v47.5,19.43 RED.1
  Bottom 0.254: v47.5,19.43 44.83,19.43 43.92,18.52 RN23.2
RGSB
  Top 0.203: U1.55 33.72,13.53 J21.1
TCK
  Top 0.203: U1.24 13.17,12.03 11.94,10.79 11.94,2.16 11.43,1.65 9.91,1.65 9.4,2.16 9.4,3.68 8.89,4.19 7.75,4.19 6.48,2.92 J3.1
  Bottom 0.203: J3.1 4.45,2.92 3.81,3.56 2.58,3.56 R10.2
TDI  (via drill 0.4)
  Top 0.203: U1.23 15.29,12.53 15.88,11.94 v15.88,11.43 14.99,10.54 14.99,7.49 15.75,6.73 16.51,6.73 17.02,6.22 17.02,4.19 J3.9
  Bottom 0.203: R12.2 v15.88,11.43
TDO
  Top 0.203: U1.25 14.35,11.11 14.35,1.52 13.84,1.02 8.51,1.02 8.13,1.4 J3.3
  pour Top (no thermals): 13.59,11.43 13.59,11.18 14.35,10.41 14.35,11.43
TMS  (via drill 0.4)
  Top 0.203: J3.5 10.67,3.43 9.4,4.7 9.4,7.47 v10.24,8.31 11.48,9.55 11.48,10.97 12.29,11.79 12.29,12.55 12.77,13.03 U1.22
  Bottom 0.203: v10.24,8.31 10.24,9.49 R11.2
VCC@1.8V  (via drill 0.4, 0.4 pad 0.8, 0.5)
  Top 0.254: U1.63 v27.69,17.53 | U1.13 v16.51,17.53
  Top 0.406: v14.61,25.53 14.61,25.02 16.51,23.11 | 16.76,23.11 17.27,23.11 | 16.76,23.11 16.51,23.11 | 16.51,23.11 v16.51,17.53 v27.69,17.53 | 17.27,23.11 16.76,22.61 | 16.51,22.35 16.76,22.61 | 16.76,22.61 16.76,23.11 | 17.27,23.11 v19.05,23.11
  Top 0.61: C3.1 13.49,26.65 v13.21,25.53 13.18,25.65
  Top 1.016: v14.61,25.53 v13.21,25.53
  Bottom 0.406: U4.5 14.66,28.23 C42.1 FB3.2 15.91,25.49 15.88,25.53 | C12.1 v27.69,17.53 | C10.1 v16.51,17.53 | 15.43,26.1 16,26.67 | 15.43,26.1 15.24,25.91 15.24,25.53 | 16,26.04 15.94,26.1 15.43,26.1 | J1.1 v19.05,23.11
  Bottom 0.813: 15.88,25.53 15.24,25.53 v14.61,25.53
  Bottom 1.016: v13.21,25.53 v14.61,25.53
  pour Bottom (no thermals): 12.95,30.61 12.95,29.46 13.72,29.46 14.1,29.08 14.1,30.35 13.84,30.61
  pour Top (no thermals): 12.19,26.67 12.19,25.65 12.57,25.27 12.95,25.27 15.24,24.38 14.99,25.65 14.99,26.16 14.22,26.92 12.45,26.92
VCC@3.3V  (via drill 0.4, 0.4 pad 0.8, 0.5)
  Top 0.254: U1.80 26.1,27.11 v26.04,27.18 | v19.1,27.18 19.1,27.13 U1.94 | U1.45 25.6,7.4 v25.6,7.37 | v18.59,7.37 18.6,7.42 U1.31 | v11.94,18.8 12.67,19.53 U1.9 | U1.59 28.7,15.53 28.42,15.24 v27.69,15.24
  Top 0.305: v11.43,12.09 8.13,8.79 J3.4
  Top 0.813: 9.02,26.29 8.66,26.65 C2.1 8.89,26.42 FB1.2
  Top 1.016: 9.02,26.29 v9.02,23.75 v10.41,23.75
  Bottom 0.203: U4.1 13.14,28.13 12.83,28.45 11.68,28.45 | U4.3 11.24,28.01 11.68,28.45 | 11.68,28.45 10.96,28.45 10.74,28.23 | FB3.1 15.88,23.88 | R12.1 15.88,7.37 | 15.88,7.75 15.49,7.37 | 15.88,8.26 15.88,7.75 | 15.88,7.75 16.26,7.37 | R11.1 11.94,9.53
  Bottom 0.305: C18.1 26.07,27.22 v26.04,27.18
  Bottom 0.406: 11.16,28.23 11.18,27.81 11.21,27.81 U4.3 | v19.1,27.18 19.09,27.22 C19.1 | C17.1 v27.69,15.24 26.04,16.89 v26.04,27.18 20.12,27.18 | v11.94,18.8 11.94,23.88 | 11.94,11.43 11.94,12.75 | 11.94,11.43 11.94,9.53 11.94,8.64 13.21,7.37 15.49,7.37 15.88,7.37 16.26,7.37 v18.59,7.37 | 11.94,12.75 v11.94,18.8 | v18.59,7.37 v25.6,7.37 25.61,7.35 C16.1 | C14.1 v11.94,18.8 | C15.1 18.59,6.21 v18.59,7.37 | v19.1,27.18 19.1,24.84 18.14,23.88 15.88,23.88 | 19.1,26.16 20.12,27.18 | 11.94,12.75 11.43,12.24 v11.43,12.09 11.43,11.94 11.94,11.43 | 20.12,27.18 v19.1,27.18
  Bottom 0.61: 11.16,28.23 10.74,28.23 C41.1 | 15.88,23.88 11.94,23.88 10.54,23.88 v10.41,23.75
  Bottom 0.813: v9.02,25.02 8.38,25.65 C41.1
  Bottom 1.016: v9.02,25.02 v9.02,23.75 v10.41,23.75
  pour Top: 8.76,23.5 8.89,23.37 10.54,23.37 10.67,23.37 10.79,23.5 10.79,23.88 9.27,25.4 8.76,25.4 8.64,25.27 8.64,23.62
  pour Bottom (no thermals): 11.43,26.92 10.92,26.92 9.78,28.07 11.43,28.07
  pour Bottom (no thermals): 8.89,23.37 11.3,23.37 11.94,22.73 13.34,24.13 10.41,24.13 8.76,25.78 8.76,27.05 9.14,27.43 10.41,27.43 10.41,28.32 8.13,28.32 8.13,24.13
  pour Bottom: 25.4,27.18 26.04,27.18 26.04,26.54
  pour Bottom: 19.18,26.54 19.18,27.18 19.81,27.18
VCCINT  (via drill 0.4)
  Top 0.254: U1.88 v22.1,23.75 | U1.39 v22.6,11.43
  Bottom 0.254: v22.1,23.75 22.1,23.07 | v22.6,11.43 22.64,11.47 C11.1
  Bottom 0.305: C13.1 22.1,23.07 22.1,20.57 21.72,20.19 J1.2 19.43,19.81 19.43,12.45 19.81,12.06 C11.1

### Text on the board
tNames: +3.3V | C1 | J11 | __/)__/)_ | FB2 | C5 | C4 | FB1 | C2 | C3 | R21 | +5V | GND | U2 | #RST | U1 | CTRL | GND | VCLK | /DS | RN12 | R | G | D0-D6 | RN11 | B | GND | RN10 | J21 | #CS | GND | R13 | #CS75 | C31 | C33 | J3 | R32 | R31 | R33 | J12 | C34 | U3 | #RST | CTRL | N64RGBv2
bNames: MaxII: / MaxV: | C41 | U4 | C42 | C19 | C18 | R22 | Don't use U4,C41,C42 / Don't use FB3!!! | FB3 | C13 | C25 | C27 | (570LEs) | C24 | C14 | J1 | C12 | C28 | C22 | RN23 | C23 | C10 | C17 | C21 | C20 | C11 | R11 | R12 | C15 | C16 | R10 | C32 | N64RGBv2_20190105
tDocu: PCB Design (c) 2017-2019 Peter Bartmann